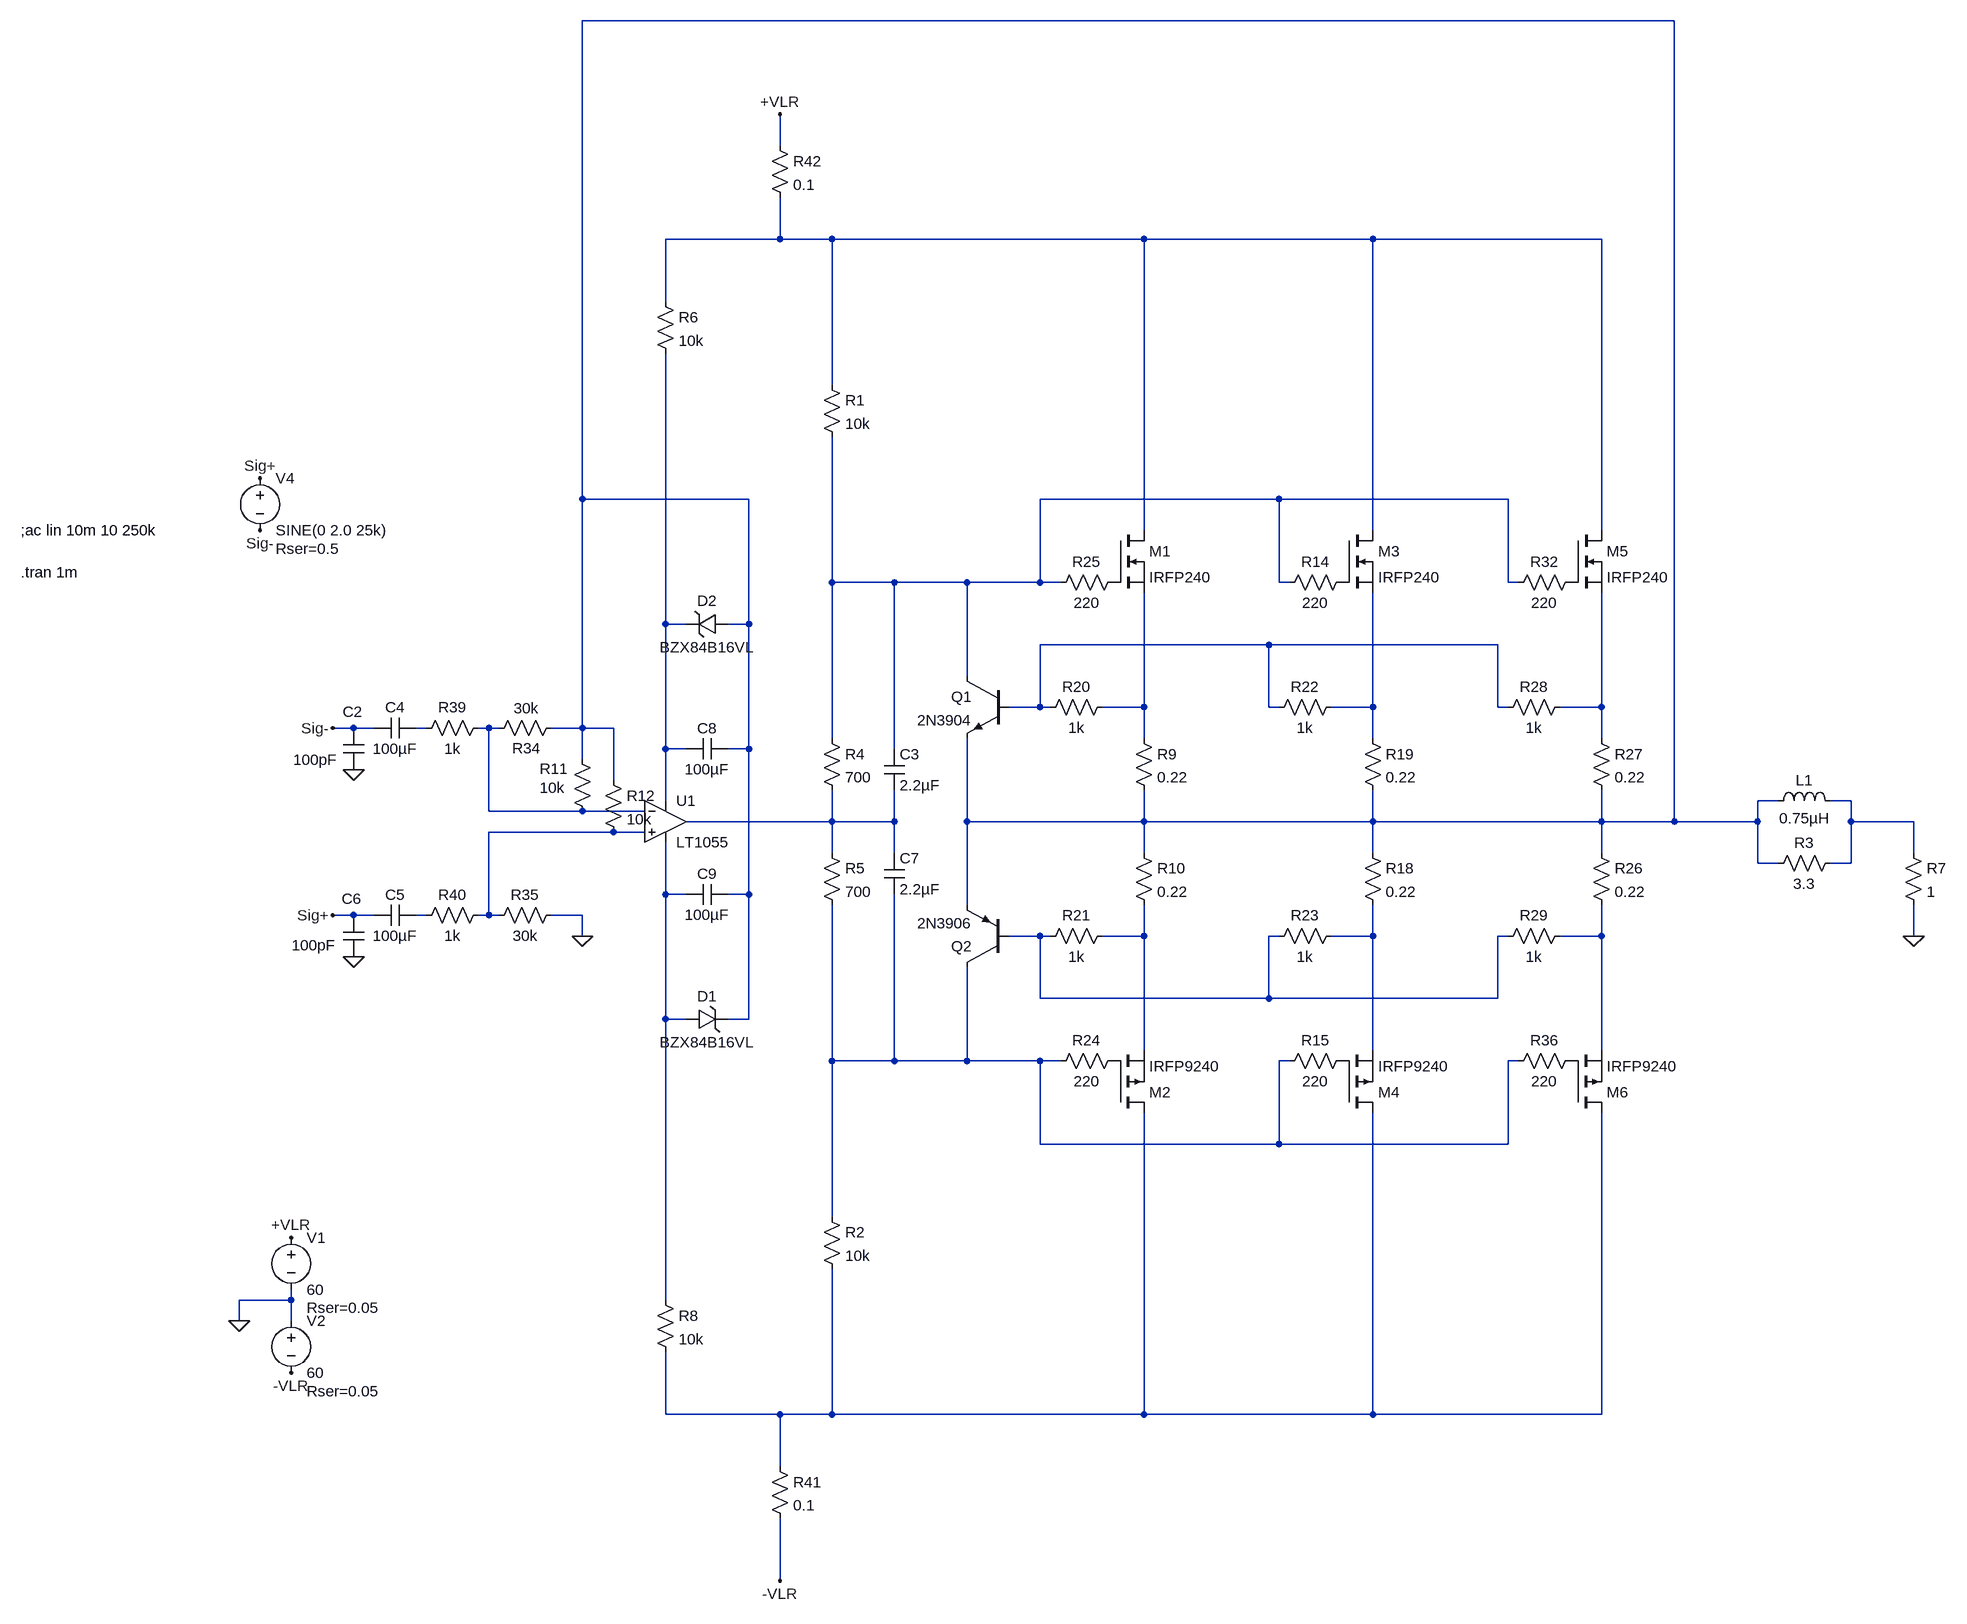
[diagram p0: schematic Feek FET Amp Final BJT drive.asc]
Feek FET Amp Final BJT drive.asc, the LTspice schematic file:
Version 4
SHEET 1 5268 2404
WIRE 304 -96 -1376 -96
WIRE -1072 96 -1072 48
WIRE -1072 240 -1072 176
WIRE -1072 240 -1248 240
WIRE -992 240 -1072 240
WIRE -512 240 -992 240
WIRE -160 240 -512 240
WIRE 192 240 -160 240
WIRE -1248 336 -1248 240
WIRE -992 464 -992 240
WIRE -1376 640 -1376 -96
WIRE -1120 640 -1376 640
WIRE -304 640 -672 640
WIRE 48 640 -304 640
WIRE -512 688 -512 240
WIRE -160 688 -160 240
WIRE 192 688 192 240
WIRE -992 768 -992 544
WIRE -896 768 -992 768
WIRE -784 768 -896 768
WIRE -672 768 -672 640
WIRE -672 768 -784 768
WIRE -640 768 -672 768
WIRE -304 768 -304 640
WIRE -288 768 -304 768
WIRE 48 768 48 640
WIRE 64 768 48 768
WIRE -1248 832 -1248 416
WIRE -1216 832 -1248 832
WIRE -1120 832 -1120 640
WIRE -1120 832 -1152 832
WIRE -320 864 -672 864
WIRE 32 864 -320 864
WIRE -784 912 -784 768
WIRE -672 960 -672 864
WIRE -672 960 -720 960
WIRE -656 960 -672 960
WIRE -512 960 -512 784
WIRE -512 960 -576 960
WIRE -320 960 -320 864
WIRE -304 960 -320 960
WIRE -160 960 -160 784
WIRE -160 960 -224 960
WIRE 32 960 32 864
WIRE 48 960 32 960
WIRE 192 960 192 784
WIRE 192 960 128 960
WIRE -1728 992 -1760 992
WIRE -1696 992 -1728 992
WIRE -1616 992 -1632 992
WIRE -1520 992 -1536 992
WIRE -1504 992 -1520 992
WIRE -1376 992 -1376 640
WIRE -1376 992 -1424 992
WIRE -1328 992 -1376 992
WIRE -992 1008 -992 768
WIRE -512 1008 -512 960
WIRE -160 1008 -160 960
WIRE 192 1008 192 960
WIRE -1248 1024 -1248 832
WIRE -1216 1024 -1248 1024
WIRE -1120 1024 -1120 832
WIRE -1120 1024 -1152 1024
WIRE -896 1024 -896 768
WIRE -1376 1040 -1376 992
WIRE -1328 1072 -1328 992
WIRE -1248 1104 -1248 1024
WIRE 464 1104 432 1104
WIRE 576 1104 544 1104
WIRE -1520 1120 -1520 992
WIRE -1376 1120 -1520 1120
WIRE -1280 1120 -1376 1120
WIRE -992 1136 -992 1088
WIRE -992 1136 -1216 1136
WIRE -896 1136 -896 1088
WIRE -896 1136 -992 1136
WIRE -784 1136 -784 1008
WIRE -512 1136 -512 1088
WIRE -512 1136 -784 1136
WIRE -160 1136 -160 1088
WIRE -160 1136 -512 1136
WIRE 192 1136 192 1088
WIRE 192 1136 -160 1136
WIRE 304 1136 304 -96
WIRE 304 1136 192 1136
WIRE 432 1136 432 1104
WIRE 432 1136 304 1136
WIRE 576 1136 576 1104
WIRE 672 1136 576 1136
WIRE -1328 1152 -1520 1152
WIRE -1280 1152 -1328 1152
WIRE -992 1184 -992 1136
WIRE -896 1184 -896 1136
WIRE -512 1184 -512 1136
WIRE -160 1184 -160 1136
WIRE 192 1184 192 1136
WIRE 672 1184 672 1136
WIRE 432 1200 432 1136
WIRE 464 1200 432 1200
WIRE 576 1200 576 1136
WIRE 576 1200 544 1200
WIRE -1248 1248 -1248 1168
WIRE -1216 1248 -1248 1248
WIRE -1120 1248 -1120 1024
WIRE -1120 1248 -1152 1248
WIRE -784 1264 -784 1136
WIRE -1728 1280 -1760 1280
WIRE -1696 1280 -1728 1280
WIRE -1616 1280 -1632 1280
WIRE -1520 1280 -1520 1152
WIRE -1520 1280 -1536 1280
WIRE -1504 1280 -1520 1280
WIRE -1376 1280 -1424 1280
WIRE -1376 1312 -1376 1280
WIRE -672 1312 -720 1312
WIRE -656 1312 -672 1312
WIRE -512 1312 -512 1264
WIRE -512 1312 -576 1312
WIRE -304 1312 -320 1312
WIRE -160 1312 -160 1264
WIRE -160 1312 -224 1312
WIRE 48 1312 32 1312
WIRE 192 1312 192 1264
WIRE 192 1312 128 1312
WIRE 672 1312 672 1264
WIRE -672 1408 -672 1312
WIRE -320 1408 -320 1312
WIRE -320 1408 -672 1408
WIRE 32 1408 32 1312
WIRE 32 1408 -320 1408
WIRE -1248 1440 -1248 1248
WIRE -1216 1440 -1248 1440
WIRE -1120 1440 -1120 1248
WIRE -1120 1440 -1152 1440
WIRE -512 1488 -512 1312
WIRE -160 1488 -160 1312
WIRE 192 1488 192 1312
WIRE -992 1504 -992 1264
WIRE -896 1504 -896 1248
WIRE -896 1504 -992 1504
WIRE -784 1504 -784 1360
WIRE -784 1504 -896 1504
WIRE -672 1504 -784 1504
WIRE -640 1504 -672 1504
WIRE -288 1504 -304 1504
WIRE 64 1504 48 1504
WIRE -672 1632 -672 1504
WIRE -304 1632 -304 1504
WIRE -304 1632 -672 1632
WIRE 48 1632 48 1504
WIRE 48 1632 -304 1632
WIRE -992 1744 -992 1504
WIRE -1824 1872 -1824 1856
WIRE -1824 1872 -1904 1872
WIRE -1248 1872 -1248 1440
WIRE -1904 1904 -1904 1872
WIRE -1824 1904 -1824 1872
WIRE -1248 2048 -1248 1952
WIRE -1072 2048 -1248 2048
WIRE -992 2048 -992 1824
WIRE -992 2048 -1072 2048
WIRE -512 2048 -512 1584
WIRE -512 2048 -992 2048
WIRE -160 2048 -160 1584
WIRE -160 2048 -512 2048
WIRE 192 2048 192 1584
WIRE 192 2048 -160 2048
WIRE -1072 2128 -1072 2048
WIRE -1072 2304 -1072 2208
FLAG 672 1312 0
FLAG -1872 608 Sig+
FLAG -1872 688 Sig-
FLAG -1824 1776 +VLR
FLAG -1824 1984 -VLR
FLAG -1072 48 +VLR
FLAG -1072 2304 -VLR
FLAG -1904 1904 0
FLAG -1760 992 Sig-
FLAG -1760 1280 Sig+
FLAG -1728 1056 0
FLAG -1728 1344 0
FLAG -1376 1312 0
SYMBOL res 656 1168 R0
SYMATTR InstName R7
SYMATTR Value 1
SYMBOL ind 448 1120 R270
WINDOW 0 32 56 VTop 2
WINDOW 3 5 56 VBottom 2
SYMATTR InstName L1
SYMATTR Value 0.75µH
SYMBOL voltage -1872 592 R0
WINDOW 39 24 124 Left 2
SYMATTR SpiceLine Rser=0.5
SYMATTR Value2 AC 1.0 0
SYMATTR InstName V4
SYMATTR Value SINE(0 2.0 25k)
SYMBOL voltage -1824 1760 R0
WINDOW 123 0 0 Left 0
WINDOW 39 24 124 Left 2
SYMATTR SpiceLine Rser=0.05
SYMATTR InstName V1
SYMATTR Value 60
SYMBOL voltage -1824 1888 R0
WINDOW 123 0 0 Left 0
WINDOW 39 24 124 Left 2
SYMATTR SpiceLine Rser=0.05
SYMATTR InstName V2
SYMATTR Value 60
SYMBOL res -1408 976 R90
WINDOW 0 63 54 VBottom 2
WINDOW 3 -30 54 VTop 2
SYMATTR InstName R34
SYMATTR Value 30k
SYMATTR SpiceLine tol=1
SYMBOL res -1408 1264 R90
WINDOW 0 0 56 VBottom 2
WINDOW 3 32 56 VTop 2
SYMATTR InstName R35
SYMATTR Value 30k
SYMATTR SpiceLine tol=1
SYMBOL cap -1632 976 R90
WINDOW 0 0 32 VBottom 2
WINDOW 3 32 32 VTop 2
SYMATTR InstName C4
SYMATTR Value 100µF
SYMBOL cap -1632 1264 R90
WINDOW 0 0 32 VBottom 2
WINDOW 3 32 32 VTop 2
SYMATTR InstName C5
SYMATTR Value 100µF
SYMBOL res -1520 976 R90
WINDOW 0 0 56 VBottom 2
WINDOW 3 32 56 VTop 2
SYMATTR InstName R39
SYMATTR Value 1k
SYMBOL res -1520 1264 R90
WINDOW 0 0 56 VBottom 2
WINDOW 3 32 56 VTop 2
SYMATTR InstName R40
SYMATTR Value 1k
SYMBOL res 560 1184 R90
WINDOW 0 0 56 VBottom 2
WINDOW 3 32 56 VTop 2
SYMATTR InstName R3
SYMATTR Value 3.3
SYMBOL cap -1744 992 R0
WINDOW 0 -1 -25 Left 2
WINDOW 3 -77 49 Left 2
SYMATTR InstName C2
SYMATTR Value 100pF
SYMBOL cap -1744 1280 R0
WINDOW 0 -2 -25 Left 2
WINDOW 3 -79 46 Left 2
SYMATTR InstName C6
SYMATTR Value 100pF
SYMBOL res -1088 2112 R0
SYMATTR InstName R41
SYMATTR Value 0.1
SYMBOL res -1088 80 R0
SYMATTR InstName R42
SYMATTR Value 0.1
SYMBOL nmos -560 688 R0
SYMATTR InstName M1
SYMATTR Value IRFP240
SYMBOL pmos -560 1584 M180
SYMATTR InstName M2
SYMATTR Value IRFP9240
SYMBOL res -528 1168 R0
SYMATTR InstName R10
SYMATTR Value 0.22
SYMBOL res -528 992 R0
SYMATTR InstName R9
SYMATTR Value 0.22
SYMBOL npn -720 912 M0
SYMATTR InstName Q1
SYMATTR Value 2N3904
SYMBOL pnp -720 1360 R180
SYMATTR InstName Q2
SYMATTR Value 2N3906
SYMBOL nmos -208 688 R0
SYMATTR InstName M3
SYMATTR Value IRFP240
SYMBOL pmos -208 1584 M180
SYMATTR InstName M4
SYMATTR Value IRFP9240
SYMBOL res -176 1168 R0
SYMATTR InstName R18
SYMATTR Value 0.22
SYMBOL res -176 992 R0
SYMATTR InstName R19
SYMATTR Value 0.22
SYMBOL res -560 944 R90
WINDOW 0 0 56 VBottom 2
WINDOW 3 32 56 VTop 2
SYMATTR InstName R20
SYMATTR Value 1k
SYMBOL res -560 1296 R90
WINDOW 0 0 56 VBottom 2
WINDOW 3 32 56 VTop 2
SYMATTR InstName R21
SYMATTR Value 1k
SYMBOL res -208 944 R90
WINDOW 0 0 56 VBottom 2
WINDOW 3 32 56 VTop 2
SYMATTR InstName R22
SYMATTR Value 1k
SYMBOL res -208 1296 R90
WINDOW 0 0 56 VBottom 2
WINDOW 3 32 56 VTop 2
SYMATTR InstName R23
SYMATTR Value 1k
SYMBOL res -192 752 R90
WINDOW 0 0 56 VBottom 2
WINDOW 3 32 56 VTop 2
SYMATTR InstName R14
SYMATTR Value 220
SYMBOL res -192 1488 R90
WINDOW 0 0 56 VBottom 2
WINDOW 3 32 56 VTop 2
SYMATTR InstName R15
SYMATTR Value 220
SYMBOL res -544 1488 R90
WINDOW 0 0 56 VBottom 2
WINDOW 3 32 56 VTop 2
SYMATTR InstName R24
SYMATTR Value 220
SYMBOL res -544 752 R90
WINDOW 0 0 56 VBottom 2
WINDOW 3 32 56 VTop 2
SYMATTR InstName R25
SYMATTR Value 220
SYMBOL nmos 144 688 R0
SYMATTR InstName M5
SYMATTR Value IRFP240
SYMBOL pmos 144 1584 M180
SYMATTR InstName M6
SYMATTR Value IRFP9240
SYMBOL res 176 1168 R0
SYMATTR InstName R26
SYMATTR Value 0.22
SYMBOL res 176 992 R0
SYMATTR InstName R27
SYMATTR Value 0.22
SYMBOL res 144 944 R90
WINDOW 0 0 56 VBottom 2
WINDOW 3 32 56 VTop 2
SYMATTR InstName R28
SYMATTR Value 1k
SYMBOL res 144 1296 R90
WINDOW 0 0 56 VBottom 2
WINDOW 3 32 56 VTop 2
SYMATTR InstName R29
SYMATTR Value 1k
SYMBOL res 160 752 R90
WINDOW 0 0 56 VBottom 2
WINDOW 3 32 56 VTop 2
SYMATTR InstName R32
SYMATTR Value 220
SYMBOL res 160 1488 R90
WINDOW 0 0 56 VBottom 2
WINDOW 3 32 56 VTop 2
SYMATTR InstName R36
SYMATTR Value 220
SYMBOL res -1008 448 R0
SYMATTR InstName R1
SYMATTR Value 10k
SYMBOL res -1008 1728 R0
SYMATTR InstName R2
SYMATTR Value 10k
SYMBOL res -1008 992 R0
SYMATTR InstName R4
SYMATTR Value 700
SYMBOL res -1008 1168 R0
SYMATTR InstName R5
SYMATTR Value 700
SYMBOL cap -912 1024 R0
SYMATTR InstName C3
SYMATTR Value 2.2µF
SYMBOL cap -912 1184 R0
SYMATTR InstName C7
SYMATTR Value 2.2µF
SYMBOL OpAmps\\LT1055 -1248 1072 R0
SYMATTR InstName U1
SYMBOL zener -1216 1456 R270
WINDOW 0 36 32 VTop 2
WINDOW 3 -4 32 VBottom 2
SYMATTR InstName D1
SYMATTR Value BZX84B16VL
SYMBOL zener -1152 816 R90
WINDOW 0 -4 32 VBottom 2
WINDOW 3 36 32 VTop 2
SYMATTR InstName D2
SYMATTR Value BZX84B16VL
SYMBOL res -1264 320 R0
SYMATTR InstName R6
SYMATTR Value 10k
SYMBOL res -1264 1856 R0
SYMATTR InstName R8
SYMATTR Value 10k
SYMBOL cap -1152 1008 R90
WINDOW 0 0 32 VBottom 2
WINDOW 3 32 32 VTop 2
SYMATTR InstName C8
SYMATTR Value 100µF
SYMBOL cap -1152 1232 R90
WINDOW 0 0 32 VBottom 2
WINDOW 3 32 32 VTop 2
SYMATTR InstName C9
SYMATTR Value 100µF
SYMBOL res -1392 1024 R0
WINDOW 0 -50 31 Left 2
WINDOW 3 -50 60 Left 2
SYMATTR InstName R11
SYMATTR Value 10k
SYMBOL res -1344 1056 R0
SYMATTR InstName R12
SYMATTR Value 10k
TEXT -2240 752 Left 2 !.tran 1m
TEXT -2240 688 Left 2 !;ac lin 10m 10 250k

The netlist it stands for:
* Feek FET Amp Final BJT drive.asc
R7 N011 0 1
L1 N001 N011 0.75µH
V4 Sig+ Sig- SINE(0 2.0 25k) AC 1.0 0 Rser=0.5
V1 +VLR 0 60 Rser=0.05
V2 0 -VLR 60 Rser=0.05
R34 N001 N010 30k tol=1
R35 0 N013 30k tol=1
C4 N009 Sig- 100µF
C5 N015 Sig+ 100µF
R39 N010 N009 1k
R40 N013 N015 1k
R3 N011 N001 3.3
C2 Sig- 0 100pF
C6 Sig+ 0 100pF
R41 N021 -VLR 0.1
R42 +VLR N002 0.1
M1 N002 P001 N006 N006 IRFP240
M2 N021 P002 N017 N017 IRFP9240
R10 N001 N017 0.22
R9 N006 N001 0.22
Q1 N003 N005 N001 0 2N3904
Q2 N020 N016 N001 0 2N3906
M3 N002 P003 N007 N007 IRFP240
M4 N021 P004 N018 N018 IRFP9240
R18 N001 N018 0.22
R19 N007 N001 0.22
R20 N006 N005 1k
R21 N017 N016 1k
R22 N007 N005 1k
R23 N018 N016 1k
R14 P003 N003 220
R15 P004 N020 220
R24 P002 N020 220
R25 P001 N003 220
M5 N002 P005 N008 N008 IRFP240
M6 N021 P006 N019 N019 IRFP9240
R26 N001 N019 0.22
R27 N008 N001 0.22
R28 N008 N005 1k
R29 N019 N016 1k
R32 P005 N003 220
R36 P006 N020 220
R1 N002 N003 10k
R2 N020 N021 10k
R4 N003 N012 700
R5 N012 N020 700
C3 N003 N012 2.2µF
C7 N012 N020 2.2µF
XU1 N013 N010 N004 N014 N012 LT1055  ; pins In+ In- V+ V- OUT
D1 N014 N001 BZX84B16VL
D2 N001 N004 BZX84B16VL
R6 N002 N004 10k
R8 N014 N021 10k
C8 N001 N004 100µF
C9 N001 N014 100µF
R11 N001 N010 10k
R12 N001 N013 10k
.model D D
.lib standard.dio
.model NPN NPN
.model PNP PNP
.lib standard.bjt
.model NMOS NMOS
.model PMOS PMOS
.lib standard.mos
.tran 1m
;ac lin 10m 10 250k
.backanno
.end